# Altium schematic sheet HDMI_TO_GMSL.SchDoc
size C; SheetNumber: 8; SheetTotal: 25
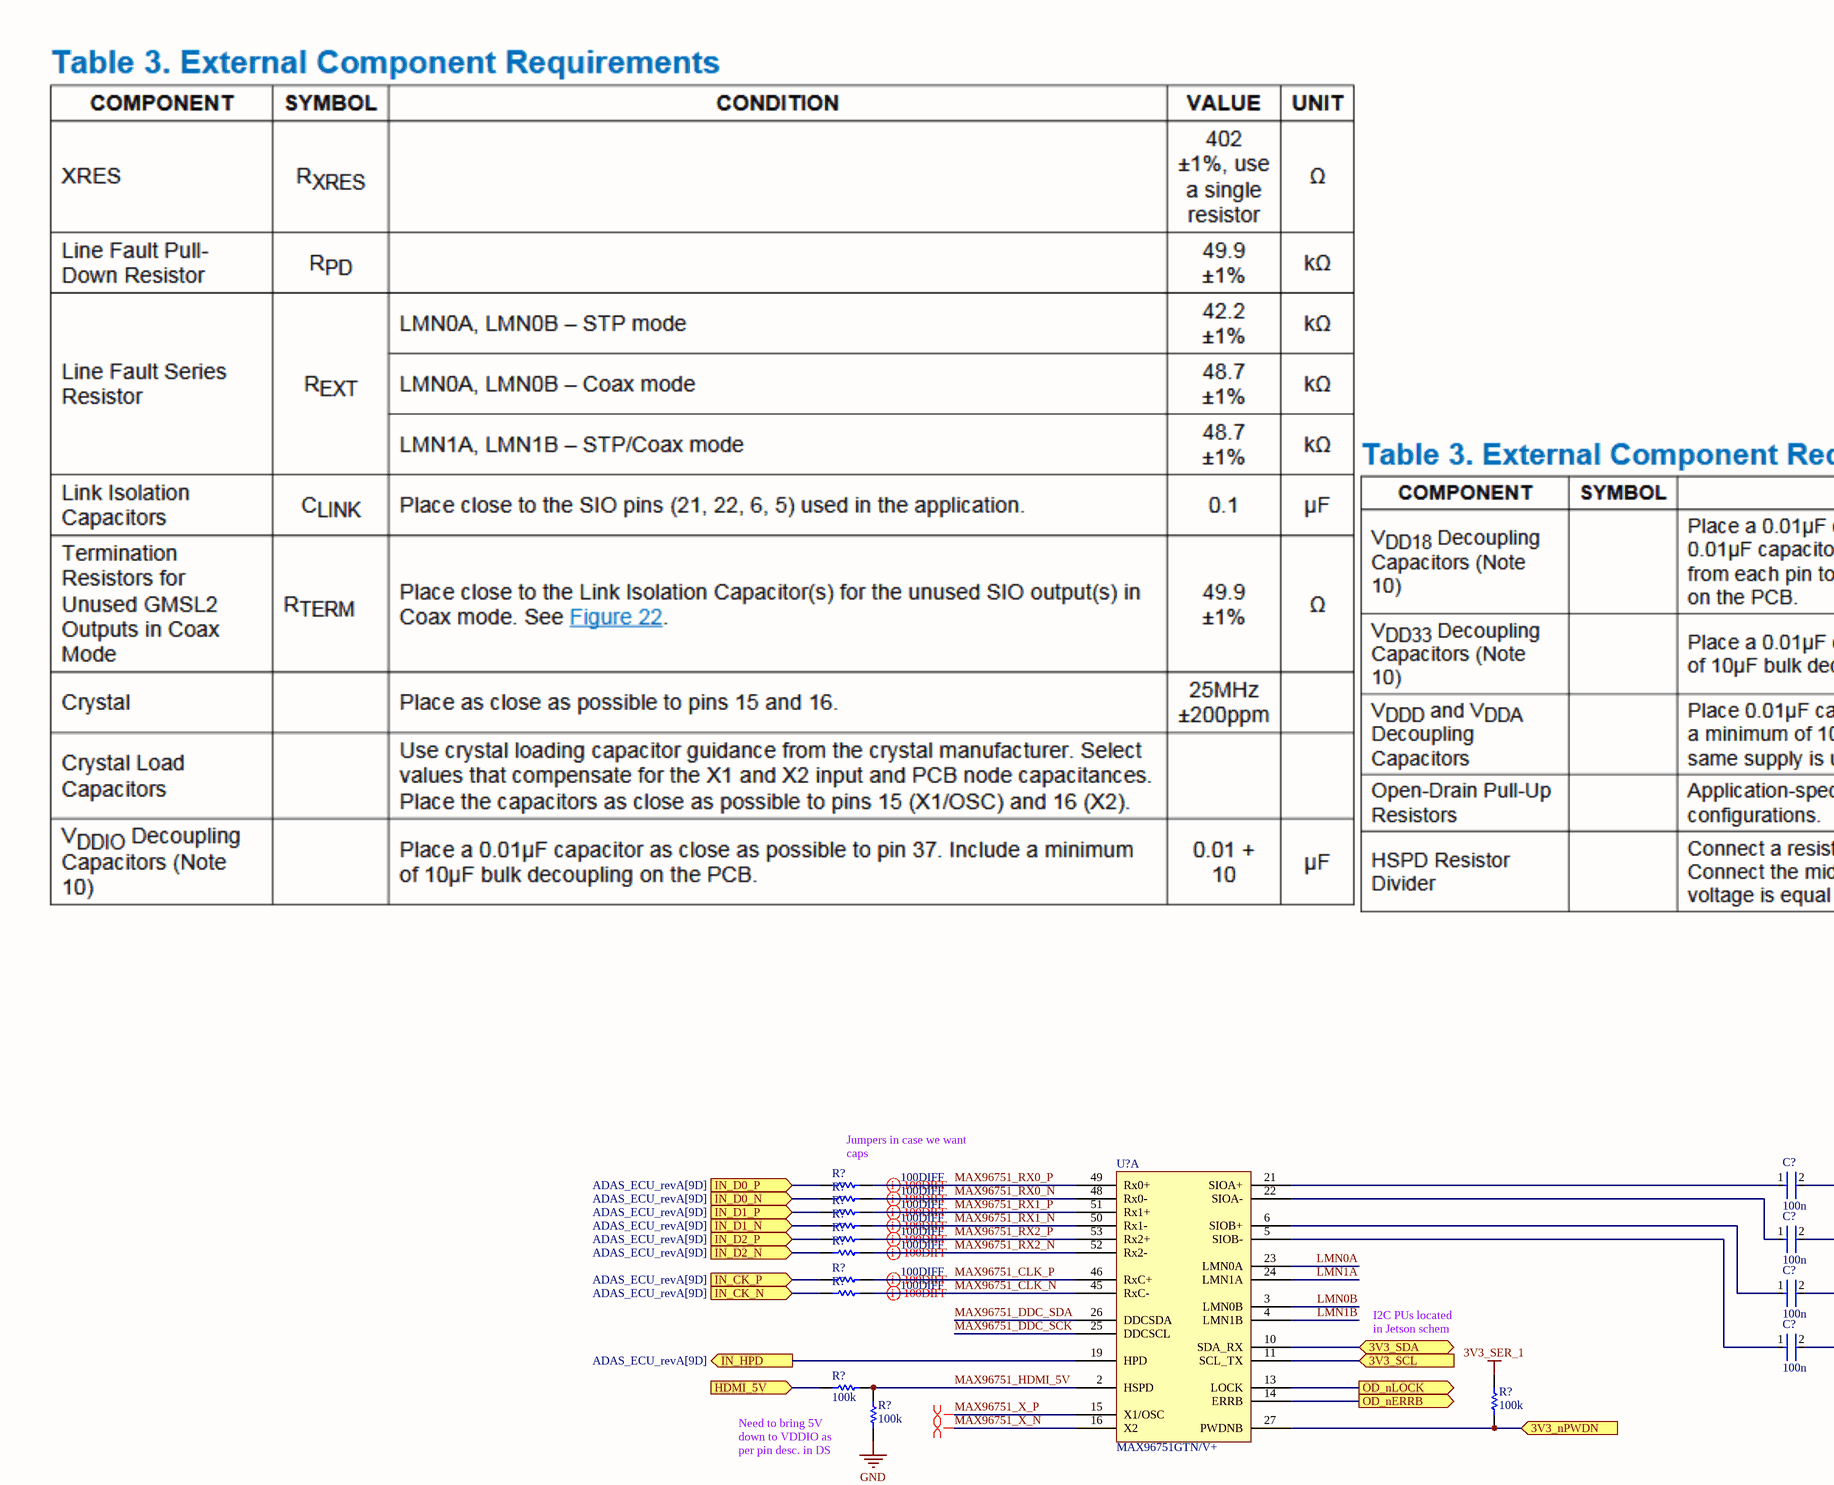
[diagram p0: HDMI_TO_GMSL.SchDoc, top left]
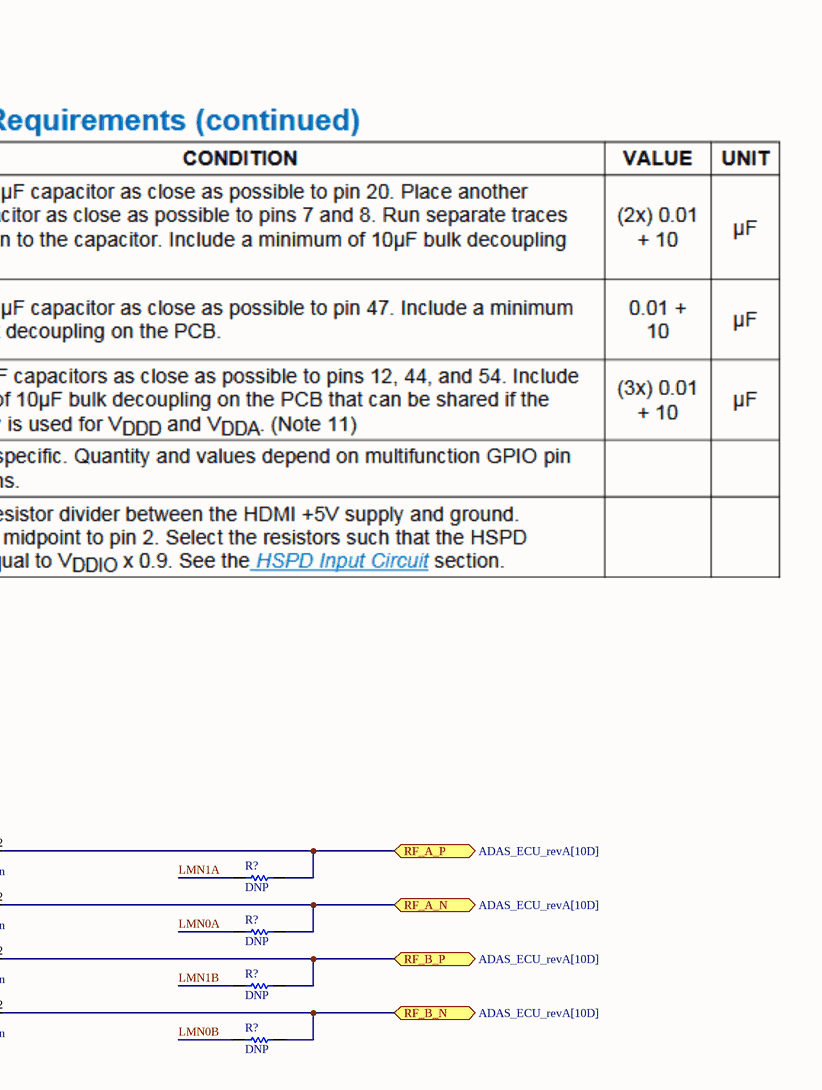
[diagram p1: HDMI_TO_GMSL.SchDoc, top right]
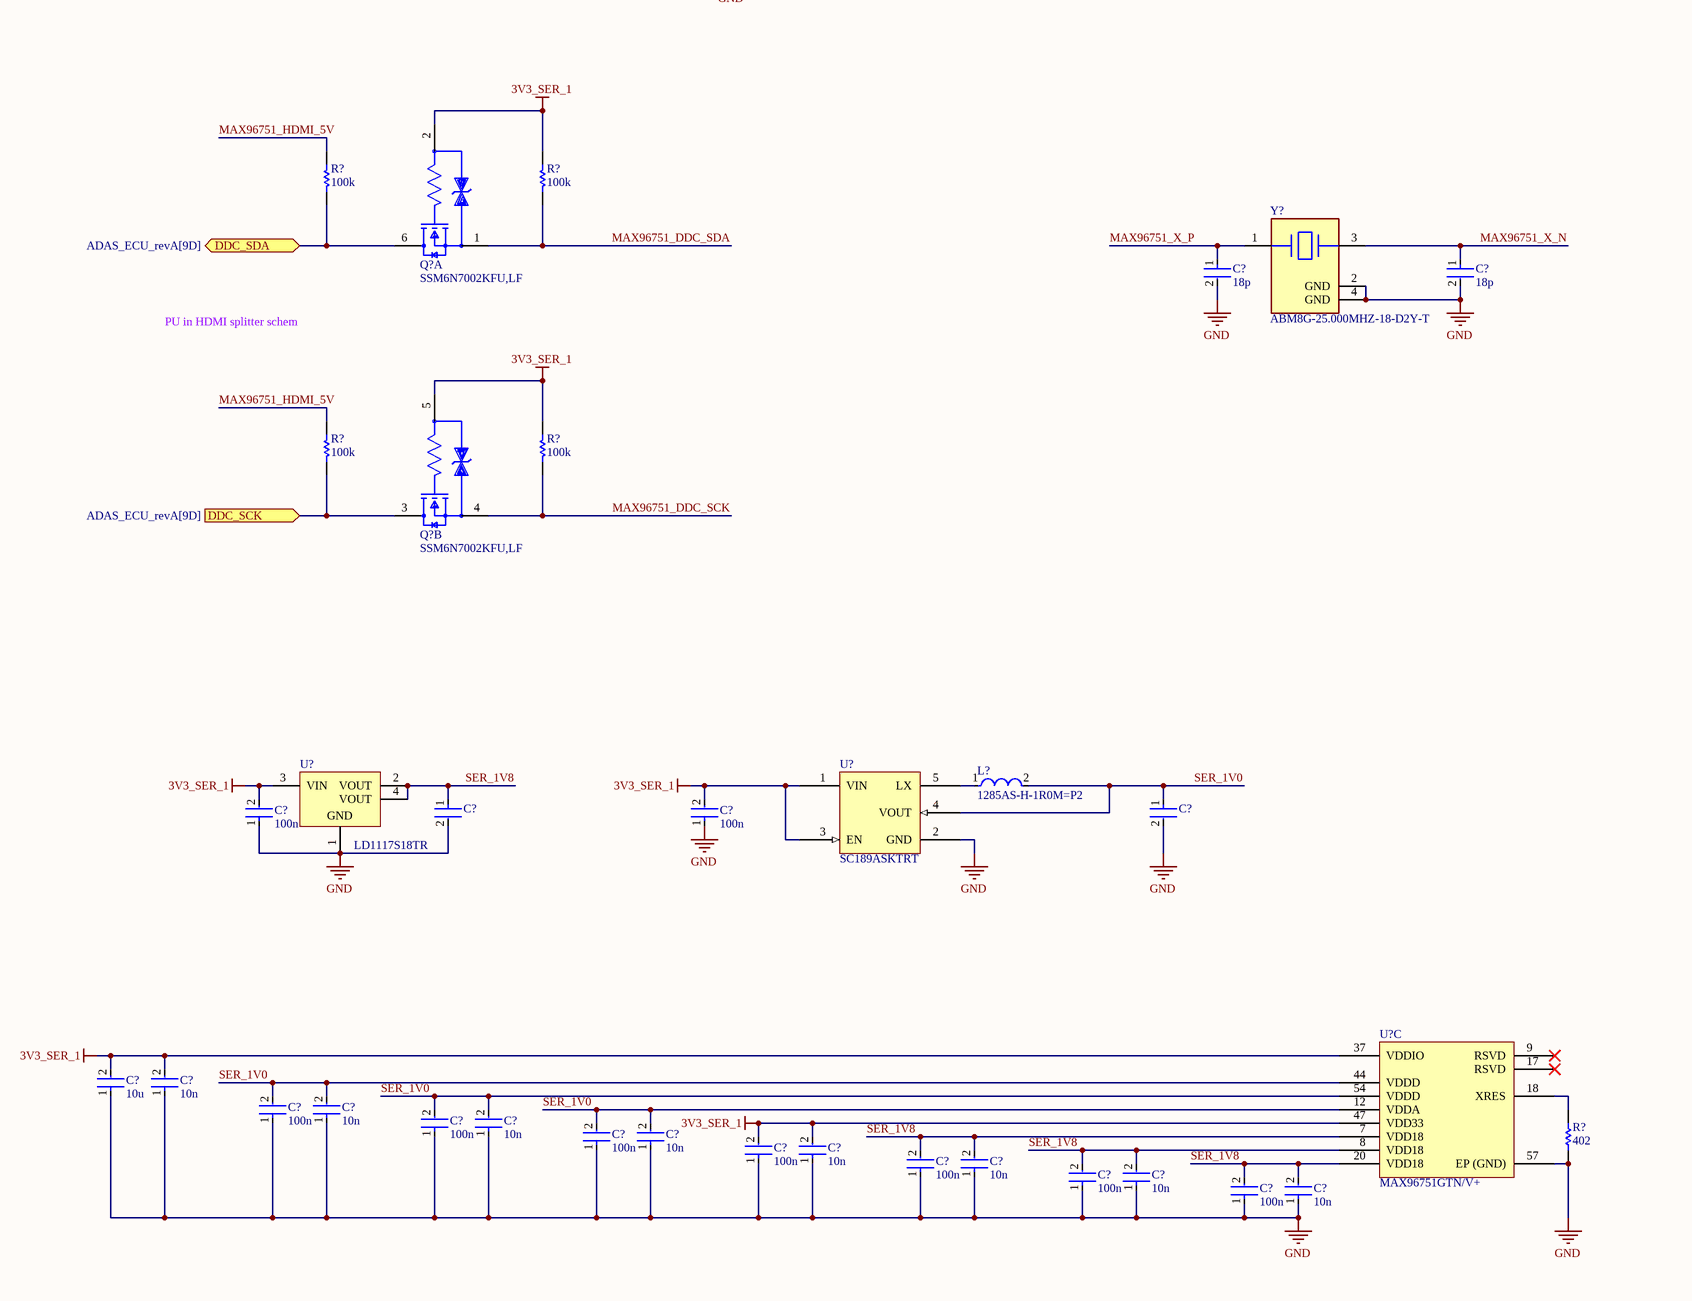
[diagram p2: HDMI_TO_GMSL.SchDoc, bottom left]
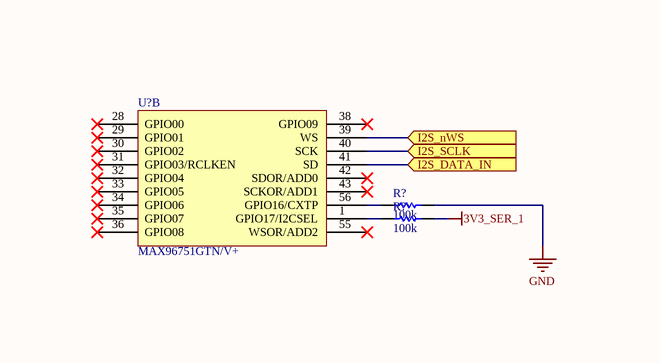
[diagram p3: HDMI_TO_GMSL.SchDoc, bottom right]

## Parts
(Parts that share a designator on the sheet are numbered #1, #2 ... from top to bottom, then left to right.)
C?#1  100n  [FP-0402-L_1_0_0_05-W_0_5-IPC_A]
C?#2  100n  [FP-0402-L_1_0_0_05-W_0_5-IPC_A]
C?#3  100n  [FP-0402-L_1_0_0_05-W_0_5-IPC_A]
C?#4  100n  [FP-0402-L_1_0_0_05-W_0_5-IPC_A]
C?#5  18p  [FP-0402-L_1_0_0_05-W_0_5-IPC_A]
C?#6  18p  [FP-0402-L_1_0_0_05-W_0_5-IPC_A]
C?#7  GRM188R60J106ME47D  [FP-GRM188-0_1-e0_2_0_55-IPC_A]  (value not drawn)
C?#8  GRM21BR61E226ME44L  [FP-GRM21B-0_2-e0_2_0_7-IPC_B]  (value not drawn)
C?#9  100n  [FP-0402-L_1_0_0_05-W_0_5-IPC_A]
C?#10  100n  [FP-0402-L_1_0_0_05-W_0_5-IPC_A]
C?#11  10u  [FP-0402-L_1_0_0_05-W_0_5-IPC_A]
C?#12  10n  [FP-0402-L_1_0_0_05-W_0_5-IPC_A]
C?#13  100n  [FP-0402-L_1_0_0_05-W_0_5-IPC_A]
C?#14  10n  [FP-0402-L_1_0_0_05-W_0_5-IPC_A]
C?#15  100n  [FP-0402-L_1_0_0_05-W_0_5-IPC_A]
C?#16  10n  [FP-0402-L_1_0_0_05-W_0_5-IPC_A]
C?#17  100n  [FP-0402-L_1_0_0_05-W_0_5-IPC_A]
C?#18  10n  [FP-0402-L_1_0_0_05-W_0_5-IPC_A]
C?#19  100n  [FP-0402-L_1_0_0_05-W_0_5-IPC_A]
C?#20  10n  [FP-0402-L_1_0_0_05-W_0_5-IPC_A]
C?#21  100n  [FP-0402-L_1_0_0_05-W_0_5-IPC_A]
C?#22  10n  [FP-0402-L_1_0_0_05-W_0_5-IPC_A]
C?#23  100n  [FP-0402-L_1_0_0_05-W_0_5-IPC_A]
C?#24  10n  [FP-0402-L_1_0_0_05-W_0_5-IPC_A]
C?#25  100n  [FP-0402-L_1_0_0_05-W_0_5-IPC_A]
C?#26  10n  [FP-0402-L_1_0_0_05-W_0_5-IPC_A]
L?  1285AS-H-1R0M=P2  [FP-DFE201610C-MFG]
Q?#1  SSM6N7002KFU,LF  [FP-SSOP6-P-0_65A-MFG]  (part A of 2)
Q?#2  SSM6N7002KFU,LF  [FP-SSOP6-P-0_65A-MFG]  (part B of 2)
R?#1  0402 JUMPER  [RESC1005X40X25ML05T05]  (value not drawn)
R?#2  0402 JUMPER  [RESC1005X40X25ML05T05]  (value not drawn)
R?#3  0402 JUMPER  [RESC1005X40X25ML05T05]  (value not drawn)
R?#4  0402 JUMPER  [RESC1005X40X25ML05T05]  (value not drawn)
R?#5  DNP  [R0603B]
R?#6  0402 JUMPER  [RESC1005X40X25ML05T05]  (value not drawn)
R?#7  0402 JUMPER  [RESC1005X40X25ML05T05]  (value not drawn)
R?#8  0402 JUMPER  [RESC1005X40X25ML05T05]  (value not drawn)
R?#9  DNP  [R0603B]
R?#10  0402 JUMPER  [RESC1005X40X25ML05T05]  (value not drawn)
R?#11  DNP  [R0603B]
R?#12  DNP  [R0603B]
R?#13  100k  [R0603B]
R?#14  100k  [R0603B]
R?#15  100k  [R0603B]
R?#16  100k  [R0603B]
R?#17  100k  [R0603B]
R?#18  100k  [R0603B]
R?#19  100k  [R0603B]
R?#20  100k  [R0603B]
R?#21  100k  [R0603B]
R?#22  402  [R0603B]
U?#1  MAX96751GTN/V+  [QFN50P800X800X80_HS-57N]  (part A of 3)
U?#2  MAX96751GTN/V+  [QFN50P800X800X80_HS-57N]  (part B of 3)
U?#3  LD1117S18TR  [SOT-223_M]
U?#4  SC189ASKTRT  [SOT95P275X145-5N]
U?#5  MAX96751GTN/V+  [QFN50P800X800X80_HS-57N]  (part C of 3)
Y?  ABM8G-25.000MHZ-18-D2Y-T  [FP-ABM8G-MFG]

## Ports
3V3_nPWDN (in), 3V3_SCL (in), 3V3_SDA (bidir), DDC_SCK (in, see ADAS_ECU_revA[9D]), DDC_SDA (bidir, see ADAS_ECU_revA[9D]), HDMI_5V (in), I2S_DATA_IN (in), I2S_nWS (in), I2S_SCLK (in), IN_CK_N (in, see ADAS_ECU_revA[9D]), IN_CK_P (in, see ADAS_ECU_revA[9D]), IN_D0_N (in, see ADAS_ECU_revA[9D]), IN_D0_P (in, see ADAS_ECU_revA[9D]), IN_D1_N (in, see ADAS_ECU_revA[9D]), IN_D1_P (in, see ADAS_ECU_revA[9D]), IN_D2_N (in, see ADAS_ECU_revA[9D]), IN_D2_P (in, see ADAS_ECU_revA[9D]), IN_HPD (out, see ADAS_ECU_revA[9D]), OD_nERRB (out), OD_nLOCK (out), RF_A_N (bidir, see ADAS_ECU_revA[10D]), RF_A_P (bidir, see ADAS_ECU_revA[10D]), RF_B_N (bidir, see ADAS_ECU_revA[10D]), RF_B_P (bidir, see ADAS_ECU_revA[10D])

## Nets
3V3_SER_1: C?#9.2 C?#10.2 C?#11.2 C?#12.2 C?#19.2 C?#20.2 Q?#1.2(Gate1) Q?#2.5(Gate2) R?#14.1 R?#17.2 R?#19.2 R?#21.2 U?#3.3(VIN) U?#4.1(VIN) U?#4.3(EN) U?#5.37(VDDIO) U?#5.47(VDD33)
GND: C?#5.2 C?#6.2 C?#7.2 C?#8.2 C?#9.1 C?#10.1 C?#11.1 C?#12.1 C?#13.1 C?#14.1 C?#15.1 C?#16.1 C?#17.1 C?#18.1 C?#19.1 C?#20.1 C?#21.1 C?#22.1 C?#23.1 C?#24.1 C?#25.1 C?#26.1 R?#15.2 R?#20.2 R?#22.2 U?#3.1(GND) U?#4.2(GND) U?#5.57(EP_(GND)) Y?.2(GND) Y?.4(GND)
3V3_nPWDN: R?#14.2 U?#1.27(PWDNB) ; port 3V3_nPWDN
3V3_SCL: U?#1.11(SCL_TX) ; port 3V3_SCL
3V3_SDA: U?#1.10(SDA_RX) ; port 3V3_SDA
DDC_SCK: Q?#2.3(Drain2) R?#18.1 ; port DDC_SCK
DDC_SDA: Q?#1.6(Drain1) R?#16.1 ; port DDC_SDA
HDMI_5V: R?#13.2 ; port HDMI_5V
I2S_DATA_IN: U?#2.41(SD) ; port I2S_DATA_IN
I2S_nWS: U?#2.39(WS) ; port I2S_nWS
I2S_SCLK: U?#2.40(SCK) ; port I2S_SCLK
IN_CK_N: R?#10.1 ; port IN_CK_N
IN_CK_P: R?#8.1 ; port IN_CK_P
IN_D0_N: R?#2.1 ; port IN_D0_N
IN_D0_P: R?#1.1 ; port IN_D0_P
IN_D1_N: R?#4.1 ; port IN_D1_N
IN_D1_P: R?#3.1 ; port IN_D1_P
IN_D2_N: R?#7.1 ; port IN_D2_N
IN_D2_P: R?#6.1 ; port IN_D2_P
IN_HPD: U?#1.19(HPD) ; port IN_HPD
LMN0A: R?#9.2 U?#1.23(LMN0A)
LMN0B: R?#12.2 U?#1.3(LMN0B)
LMN1A: R?#5.2 U?#1.24(LMN1A)
LMN1B: R?#11.2 U?#1.4(LMN1B)
MAX96751_CLK_N: R?#10.2 U?#1.45(RxC-)
MAX96751_CLK_P: R?#8.2 U?#1.46(RxC+)
MAX96751_DDC_SCK: Q?#2.4(Source2) R?#19.1 U?#1.25(DDCSCL)
MAX96751_DDC_SDA: Q?#1.1(Source1) R?#17.1 U?#1.26(DDCSDA)
MAX96751_HDMI_5V: R?#13.1 R?#15.1 R?#16.2 R?#18.2 U?#1.2(HSPD)
MAX96751_RX0_N: R?#2.2 U?#1.48(Rx0-)
MAX96751_RX0_P: R?#1.2 U?#1.49(Rx0+)
MAX96751_RX1_N: R?#4.2 U?#1.50(Rx1-)
MAX96751_RX1_P: R?#3.2 U?#1.51(Rx1+)
MAX96751_RX2_N: R?#7.2 U?#1.52(Rx2-)
MAX96751_RX2_P: R?#6.2 U?#1.53(Rx2+)
MAX96751_X_N: C?#6.1 U?#1.16(X2) Y?.3
MAX96751_X_P: C?#5.1 U?#1.15(X1/OSC) Y?.1
OD_nERRB: U?#1.14(ERRB) ; port OD_nERRB
OD_nLOCK: U?#1.13(LOCK) ; port OD_nLOCK
RF_A_N: C?#2.2 R?#9.1 ; port RF_A_N
RF_A_P: C?#1.2 R?#5.1 ; port RF_A_P
RF_B_N: C?#4.2 R?#12.1 ; port RF_B_N
RF_B_P: C?#3.2 R?#11.1 ; port RF_B_P
SER_1V0: C?#8.1 C?#13.2 C?#14.2 C?#15.2 C?#16.2 C?#17.2 C?#18.2 L?.2 U?#4.4(VOUT) U?#5.12(VDDA) U?#5.44(VDDD) U?#5.54(VDDD)
SER_1V8: C?#7.1 C?#21.2 C?#22.2 C?#23.2 C?#24.2 C?#25.2 C?#26.2 U?#3.2(VOUT) U?#3.4(VOUT) U?#5.7(VDD18) U?#5.8(VDD18) U?#5.20(VDD18)
NetC?#1_1: C?#1.1 U?#1.21(SIOA+)
NetC?#2_1: C?#2.1 U?#1.22(SIOA-)
NetC?#3_1: C?#3.1 U?#1.6(SIOB+)
NetC?#4_1: C?#4.1 U?#1.5(SIOB-)
NetL?_1: L?.1 U?#4.5(LX)
NetR?#20_1: R?#20.1 U?#2.56(GPIO16/CXTP)
NetR?#21_1: R?#21.1 U?#2.1(GPIO17/I2CSEL)
NetR?#22_1: R?#22.1 U?#5.18(XRES)

Not connected (* = marked no-connect by the designer): U?#2 28(GPIO00)* 29(GPIO01)* 30(GPIO02)* 31(GPIO03/RCLKEN)* 32(GPIO04)* 33(GPIO05)* 34(GPIO06)* 35(GPIO07)* 36(GPIO08)* 38(GPIO09)* 42(SDOR/ADD0)* 43(SCKOR/ADD1)* 55(WSOR/ADD2)*; U?#5 9(RSVD)* 17(RSVD)*

## Layout directives
differential pair: MAX96751_X_N, MAX96751_X_P
differential pair; differential pair class 100DIFF: MAX96751_CLK_N, MAX96751_CLK_P, MAX96751_RX0_N, MAX96751_RX0_P, MAX96751_RX1_N, MAX96751_RX1_P, MAX96751_RX2_N, MAX96751_RX2_P

## Notes on the sheet
- (near R?#1) Jumpers in case we want caps
- I2C PUs located in Jetson schem
- (near R?#13) Need to bring 5V down to VDDIO as per pin desc. in DS
- PU in HDMI splitter schem

## Library data of the parts
C?#1-C?#6 C?#9-C?#26 = CMP-001-00058-1: LARGE PADS, 0402 CAP, CHANGE COMMENT TO MATCH REAL P/N; Capacitor Type: Ceramic; Min Operating Temperature: -55°C; Mounting Technology: Surface Mount; Pins: 2; Case/Package: 0402; RoHS Compliant: Yes; Max Operating Temperature: 85°C
C?#7 = CMP-2006-02792-2: Chip Multilayer Ceramic Capacitors for General Purpose, 0603, 10uF, X5R, 15%, 20%, 6.3V; Packaging: Tape and Reel; Voltage Rating (DC): 6.3V; Width: 0.031inch; Termination: SMD/SMT; Dielectric: X5R; Package Quantity: 4000; Voltage Rating: 6.3V; Capacitance: 10uF; Case/Package: 0603; Min Operating Temperature: -55°C; Voltage: 6.3V; Length: 1.6mm; Thickness: 0.035inch; Lead Free: Lead Free; Depth: 0.8mm; Case Code (Imperial): 0603; Max Operating Temperature: 85°C; Material: Ceramic; Height: 0.8mm; Tolerance: 20%; Mount: Surface Mount; REACH SVHC: No SVHC; Radiation Hardening: No; Case Code (Metric): 1608
C?#8 = CMP-2007-03222-3: Chip Multilayer Ceramic Capacitors for General Purpose, 0805, 22uF, X5R, 15%, 20%, 25V; Case/Package: 0805; Depth: 1.25mm; Resistor Type: Ceramic; Voltage Rating: 25V; Lead Free: Lead Free; Voltage Rating (DC): 25V; Case Code (Metric): 2012; Thickness: 0.057inch; REACH SVHC: No SVHC; Material: Ceramic; Tolerance: 20%; Length: 2mm; Capacitance: 22uF; Case Code (Imperial): 0805; Max Operating Temperature: 85°C; Termination: SMD/SMT; Weight: 0.000335oz; Dielectric: X5R; Packaging: Tape and Reel; Voltage: 25V; Package Quantity: 3000; Height: 1.25mm; Mount: Surface Mount; Width: 1.25mm; Min Operating Temperature: -55°C
L? = CMP-06042-000137-1: FIXED IND 1UH 2.2A 96 MOHM SMD; Max DC Current: 2.3A; Shielding: Shielded; Test Frequency: 1MHz; Core Material: Ferrite; Tolerance: 20%; DC Resistance (DCR): 96mR; Case Code (Metric): 2012; Case/Package: 0805; Case Code (Imperial): 0805; Resistor Type: Wirewound; Depth: 1.6mm; Width: 0.063inch; Inductance: 1uH; Max Operating Temperature: 85°C; Length: 0.079inch; Lead Free: Lead Free; Height - Seated (Max): 0.039inch; Current Rating: 2.2A; Min Operating Temperature: -40°C; Mount: Surface Mount; Packaging: Tape and Reel
Q?#1 Q?#2 = CMP-35916-000009-1: MOSFET 2N-CH 60V 0.3A; Input Capacitance: 40pF; Continuous Drain Current (ID): 300mA; Max Power Dissipation: 285mW; FET Type: 2 N-Channel; Rds On Max: 1.5R; Mount: Surface Mount; Drain to Source Voltage (Vdss): 60V; Packaging: Tape and Reel
R?#1-R?#4 R?#6-R?#8 R?#10 = CMP-009-00118-2: READ THE NAME; Pins: 2; Component Type: Standard; Design Item ID: CMP-009-00206-2; Source: 0402jump.SchLib
R?#5 R?#9 R?#11-R?#22 = CMP-009-00002-14: Resistor
U?#1 = CMP-015-00018-2: GMSL2 Serializer with HDMI 2.0 Input
U?#2 U?#5 = CMP-015-00018-1: GMSL2 Serializer with HDMI 2.0 Input
U?#3 = CMP-0244-00308-1: Fixed Low Drop Positive Voltage Regulator, 1.8V, 4-Pin SOT-223, Tape and Reel; ComponentLink1URL: http://www.st.com; PackageReference: SOT-223; PackageDescription: 4-Pin SOT-223 Package, 6.5 x 3.5 mm Body, 2.3 mm Pitch, 7 mm Lead Span; ComponentLink2URL: http://www.st.com/internet/com/TECHNICAL_RESOURCES/TECHNICAL_LITERATURE/DATASHEET/CD00000544.pdf; ComponentLink2Description: Datasheet; ComponentLink1Description: Manufacturer URL; DatasheetVersion: 1/11/2011; PackageVersion: 2010
U?#4 = CMP-019-00061-1: Switching Regulator, Voltage-mode, 1.5A, 3000kHz Switching Freq-Max, PDSO5; Max Supply Voltage: 5.5V; Output Voltage: 1V; Mounting Technology: Surface Mount; Case/Package: SOT-23-5; Min Operating Temperature: -40°C; Max Operating Temperature: 85°C; Pins: 6
Y? = CMP-2000-05733-3: Crystal 25MHz ±20ppm (Tol) ±30ppm (Stability) 18pF FUND 60Ω 4-Pin SMD T/R; Series Resistance: 60R; Length: 3.2mm; Depth: 2.5mm; Packaging: Tape and Reel; Min Operating Temperature: -40°C; Operating Frequency: 25 MHz; Lead Free: Lead Free; Number of Pins: 4; Frequency Tolerance: 20ppm; Radiation Hardening: No; Max Operating Temperature: 85°C; Termination: SMD/SMT; Frequency Stability: 30ppm; Frequency: 25MHz; Series: ABM8G; Mount: Surface Mount; Package Quantity: 1000; Height: 0.039inch; Width: 0.098inch; Case/Package: CSMD; ESR (Equivalent Series Resistance): 60R; Load Capacitance: 18pF; Tolerance: 20ppm